# EAGLE design motorcontroller (EAGLE 5.11)
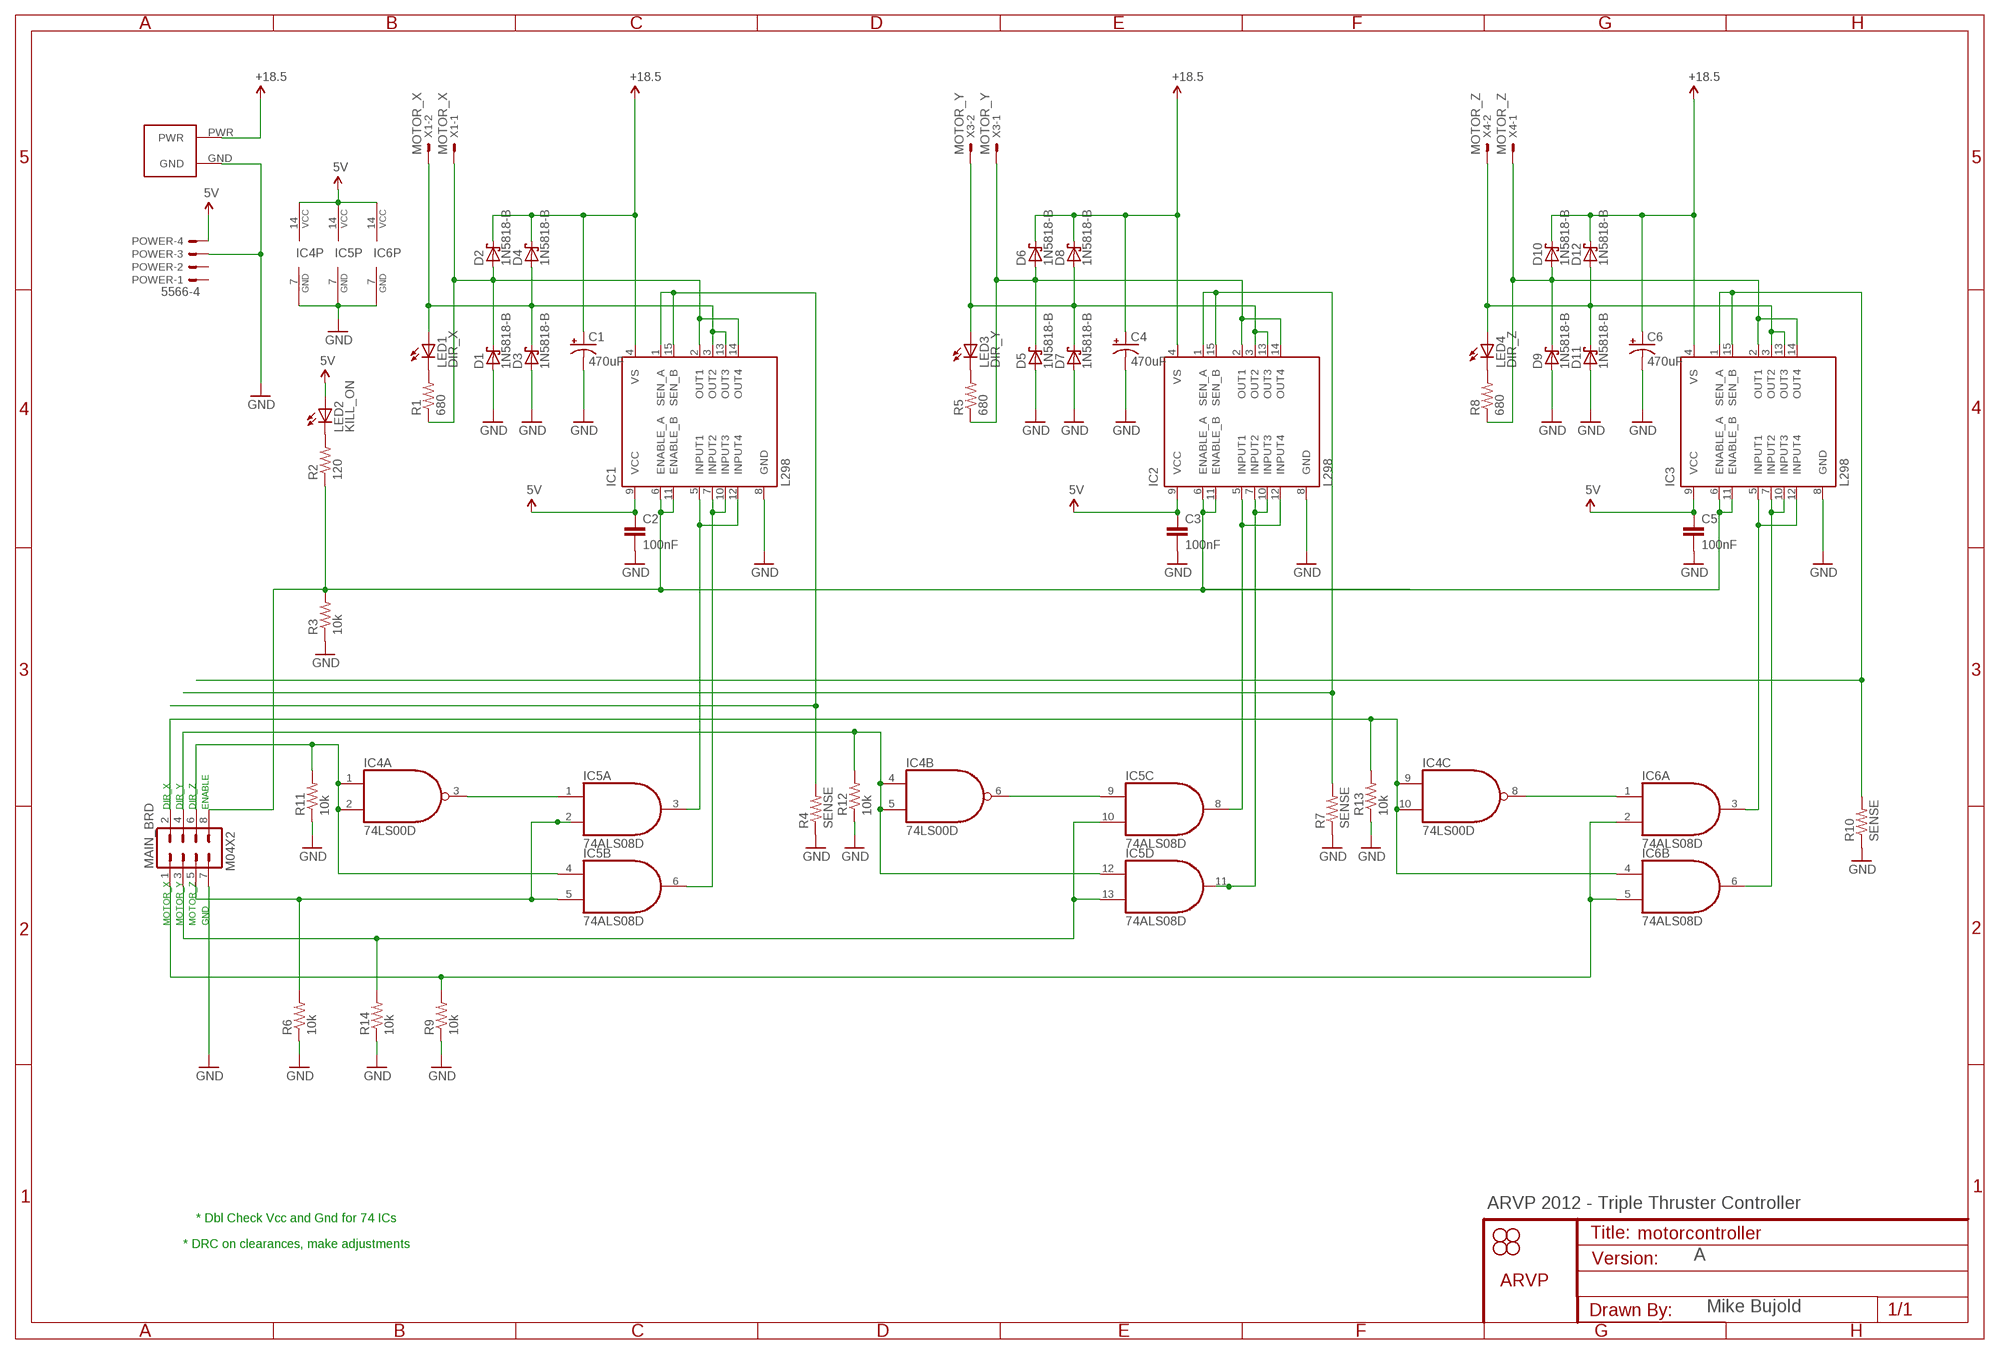
[diagram p0: schematic, sheet 1]

## Parts
C1  470uF  CAP_POLPTH4  [CPOL-RADIAL-1000UF-25V]
C2  100nF  CAPPTH  [CAP-PTH-SMALL]
C3  100nF  CAPPTH  [CAP-PTH-SMALL]
C4  470uF  CAP_POLPTH4  [CPOL-RADIAL-1000UF-25V]
C5  100nF  CAPPTH  [CAP-PTH-SMALL]
C6  470uF  CAP_POLPTH4  [CPOL-RADIAL-1000UF-25V]
D1  1N5818-B  [DO41-7.6]
D2  1N5818-B  [DO41-7.6]
D3  1N5818-B  [DO41-7.6]
D4  1N5818-B  [DO41-7.6]
D5  1N5818-B  [DO41-7.6]
D6  1N5818-B  [DO41-7.6]
D7  1N5818-B  [DO41-7.6]
D8  1N5818-B  [DO41-7.6]
D9  1N5818-B  [DO41-7.6]
D10  1N5818-B  [DO41-7.6]
D11  1N5818-B  [DO41-7.6]
D12  1N5818-B  [DO41-7.6]
IC1  L298  [MULTIWATT-15]
IC2  L298  [MULTIWATT-15]
IC3  L298  [MULTIWATT-15]
IC4  74LS00D  [SO14]
IC5  74ALS08D  [SO14]
IC6  74ALS08D  [SO14]
JP1  STAND-OFF  [STAND-OFF]
JP2  STAND-OFF  [STAND-OFF]
JP3  STAND-OFF  [STAND-OFF]
JP4  STAND-OFF  [STAND-OFF]
LED1  DIR_X  LED5MM  [LED5MM]
LED2  KILL_ON  LED5MM  [LED5MM]
LED3  DIR_Y  LED5MM  [LED5MM]
LED4  DIR_Z  LED5MM  [LED5MM]
MAIN_BRD  M04X2  [2X4]
POWER  5566-4  [5566-4]
R1  680  RESISTORPTH-1/4W  [AXIAL-0.4]
R2  120  RESISTORPTH-1/4W  [AXIAL-0.4]
R3  10k  RESISTORPTH-1/4W  [AXIAL-0.4]
R4  SENSE  RESISTORPTH-2W  [AXIAL-0.8]
R5  680  RESISTORPTH-1/4W  [AXIAL-0.4]
R6  10k  RESISTOR1206  [1206]
R7  SENSE  RESISTORPTH-2W  [AXIAL-0.8]
R8  680  RESISTORPTH-1/4W  [AXIAL-0.4]
R9  10k  RESISTOR1206  [1206]
R10  SENSE  RESISTORPTH-2W  [AXIAL-0.8]
R11  10k  RESISTOR1206  [1206]
R12  10k  RESISTOR1206  [1206]
R13  10k  RESISTOR1206  [1206]
R14  10k  RESISTOR1206  [1206]
U$4  ARVP_LOGO  [ARVP]
U$7  AND_PWR  [AND_PWR]
X1  MOTOR_X  KK-156-2  [KK-156-2]
X3  MOTOR_Y  KK-156-2  [KK-156-2]
X4  MOTOR_Z  KK-156-2  [KK-156-2]

## Nets
5V: C2.1 C3.1 C5.1 IC1.9(VCC) IC2.9(VCC) IC3.9(VCC) IC4.14(P:VCC) IC5.14(P:VCC) IC6.14(P:VCC) LED2.A POWER.4
18.5V: C1.1(+) C4.1(+) C6.1(+) D2.C D4.C D6.C D8.C D10.C D12.C IC1.4(VS) IC2.4(VS) IC3.4(VS) U$7.PWR ; supply symbol labelled +18.5
GND: C1.2(-) C2.2 C3.2 C4.2(-) C5.2 C6.2(-) D1.A D3.A D5.A D7.A D9.A D11.A IC1.8(GND) IC2.8(GND) IC3.8(GND) IC4.7(P:GND) IC5.7(P:GND) IC6.7(P:GND) MAIN_BRD.7 POWER.3 R3.P$1 R4.P$1 R6.1 R7.P$1 R9.1 R10.P$1 R11.1 R12.1 R13.1 R14.1 U$7.GND
N$2: IC1.1(SEN_A) IC1.15(SEN_B) R4.P$2
N$3: LED2.K(C) R2.P$2
N$4: IC2.5(INPUT1) IC2.12(INPUT4) IC5.8(C:O)
N$5: IC1.5(INPUT1) IC1.12(INPUT4) IC5.3(A:O)
N$6: IC1.7(INPUT2) IC1.10(INPUT3) IC5.6(B:O)
N$7: D1.C D2.A IC1.2(OUT1) IC1.14(OUT4) R1.P$1 X1.1
N$8: D3.C D4.A IC1.3(OUT2) IC1.13(OUT3) LED1.A X1.2
N$9: LED1.K(C) R1.P$2
N$10: IC2.7(INPUT2) IC2.10(INPUT3) IC5.11(D:O)
N$11: D5.C D6.A IC2.2(OUT1) IC2.14(OUT4) R5.P$1 X3.1
N$12: D7.C D8.A IC2.3(OUT2) IC2.13(OUT3) LED3.A X3.2
N$13: IC4.8(C:O) IC6.1(A:I0)
N$14: LED3.K(C) R5.P$2
N$15: IC2.1(SEN_A) IC2.15(SEN_B) R7.P$2
N$16: IC3.5(INPUT1) IC3.12(INPUT4) IC6.3(A:O)
N$17: IC3.7(INPUT2) IC3.10(INPUT3) IC6.6(B:O)
N$18: D9.C D10.A IC3.2(OUT1) IC3.14(OUT4) R8.P$1 X4.1
N$19: D11.C D12.A IC3.3(OUT2) IC3.13(OUT3) LED4.A X4.2
N$20: IC6.2(A:I1) IC6.5(B:I1) MAIN_BRD.1 R9.2
N$21: LED4.K(C) R8.P$2
N$22: IC1.6(ENABLE_A) IC1.11(ENABLE_B) IC2.6(ENABLE_A) IC2.11(ENABLE_B) IC3.6(ENABLE_A) IC3.11(ENABLE_B) MAIN_BRD.8 R2.P$1 R3.P$2
N$25: IC4.6(B:O) IC5.9(C:I0)
N$26: IC5.2(A:I1) IC5.5(B:I1) MAIN_BRD.5 R6.2
N$27: IC4.3(A:O) IC5.1(A:I0)
N$28: IC3.1(SEN_A) IC3.15(SEN_B) R10.P$2
N$31: IC5.10(C:I1) IC5.13(D:I1) MAIN_BRD.3 R14.2
N$36: IC4.1(A:I0) IC4.2(A:I1) IC5.4(B:I0) MAIN_BRD.6 R11.2
N$37: IC4.4(B:I0) IC4.5(B:I1) IC5.12(D:I0) MAIN_BRD.4 R12.2
N$38: IC4.9(C:I0) IC4.10(C:I1) IC6.4(B:I0) MAIN_BRD.2 R13.2
Unconnected: IC4.11(D:O) IC4.12(D:I0) IC4.13(D:I1) IC6.8(C:O) IC6.9(C:I0) IC6.10(C:I1) IC6.11(D:O) IC6.12(D:I0) IC6.13(D:I1) POWER.1 POWER.2

## Notes on the sheet
- DIR_X | DIR_Y | DIR_Z | ENABLE
- MOTOR_X | MOTOR_Y | MOTOR_Z | GND
- ARVP 2012 - Triple Thruster Controller
- * Dbl Check Vcc and Gnd for 74 ICs
- * DRC on clearances, make adjustments
- A
- Mike Bujold

## Library data of the parts
C1 C4 C6 = SparkFun:CAP_POL: Capacitor Polarized These are standard SMD and PTH capacitors. Normally 10uF, 47uF, and 100uF in electrolytic and tantalum varieties. Always verify the external diameter of the through hole cap, it varies with capacity, voltage, and manufacturer. The EIA devices should be standard.
C2 C3 C5 = SparkFun:CAP: Capacitor Standard 0603 ceramic capacitor, and 0.1" leaded capacitor.
D1-D12 = diode:1N581*: 1.0A SCHOTTKY BARRIER RECTIFIER Source: http://www.diodes.com/datasheets/ds23001.pdf
IC1-IC3 = st-microelectronics:L298: DUAL FULL-BRIDGE DRIVER; MPN: L298N; OC_FARNELL: 1589425; OC_NEWARK: 32M1527
IC4 = 74xx-us:74*00: Quad 2-input NAND gate
IC5 IC6 = 74xx-us:74*08: Quad 2-input AND gate
JP1-JP4 = SparkFun:STAND-OFF: Stand Off This is the mechanical footprint for a #4 phillips button head screw. Use the keepout ring to avoid running the screw head into surrounding components. SKU : PRT-00447
LED1-LED4 = led:LED: LED OSRAM: - CHIPLED LG R971, LG N971, LY N971, LG Q971, LY Q971, LO R971, LY R971 LH N974, LH R974 LS Q976, LO Q976, LY Q976 LO Q996 - Hyper CHIPLED LW Q18S LB Q993, LB Q99A, LB R99A - SideLED LS A670, LO A670, LY A670, LG A670, LP A670 LB A673, LV A673, LT A673, LW A673 LH A674 LY A675 LS A676, LA A676, LO A676, LY A676, LW A676 LS A679, LY A679, LG A679 - Hyper Micro SIDELED® LS Y876, LA Y876, LO Y876, LY Y876 LT Y87S - SmartLED LW L88C, LW L88S LB L89C, LB L89S, LG L890 LS L89K, LO L89K, LY L89K LS L896, LA L896, LO L896, LY L896 - TOPLED LS T670, LO T670, LY T670, LG T670, LP T670 LSG T670, LSP T670, LSY T670, LOP T670, LYG T670 LG T671, LOG T671, LSG T671 LB T673, LV T673, LT T673, LW T673 LH T674 LS T676, LA T676, LO T676, LY T676, LB T676, LH T676, LSB T676, LW T676 LB T67C, LV T67C, LT T67C, LS T67K, LO T67K, LY T67K, LW E67C LS E67B, LA E67B, LO E67B, LY E67B, LB E67C, LV E67C, LT E67C LW T67C LS T679, LY T679, LG T679 LS T770, LO T770, LY T770, LG T770, LP T770 LB T773, LV T773, LT T773, LW T773 LH T774 LS E675, LA E675, LY E675, LS T675 LS T776, LA T776, LO T776, LY T776, LB T776 LHGB T686 LT T68C, LB T68C - Hyper Mini TOPLED® LB M676 - Mini TOPLED Santana® LG M470 LS M47K, LO M47K, LY M47K Source: http://www.osram.convergy.de LUXEON: - LUMILED® LXK2-PW12-R00, LXK2-PW12-S00, LXK2-PW14-U00, LXK2-PW14-V00 LXK2-PM12-R00, LXK2-PM12-S00, LXK2-PM14-U00 LXK2-PE12-Q00, LXK2-PE12-R00, LXK2-PE12-S00, LXK2-PE14-T00, LXK2-PE14-U00 LXK2-PB12-K00, LXK2-PB12-L00, LXK2-PB12-M00, LXK2-PB14-N00, LXK2-PB14-P00, LXK2-PB14-Q00 LXK2-PR12-L00, LXK2-PR12-M00, LXK2-PR14-Q00, LXK2-PR14-R00 LXK2-PD12-Q00, LXK2-PD12-R00, LXK2-PD12-S00 LXK2-PH12-R00, LXK2-PH12-S00 LXK2-PL12-P00, LXK2-PL12-Q00, LXK2-PL12-R00 Source: www.luxeon.com KINGBRIGHT: KA-3528ASYC Source: www.kingbright.com
MAIN_BRD = SparkFun:M04X2
POWER = con-molex:5566-4: Mini FIT connector 4 pol Source: http://www.molex.com; OC_FARNELL: unknown; OC_NEWARK: unknown
R1-R14 = SparkFun:RESISTOR: Resistor Basic schematic elements and footprints for 0603, 1206, and PTH resistors.
U$4 = ARVP:ARVP_LOGO
U$7 = ARVP:AND_PWR
X1 X3 X4 = con-molex:KK-156-2: KK 156 HEADER Source: http://www.molex.com/pdm_docs/sd/026604100_sd.pdf; OC_FARNELL: unknown; OC_NEWARK: unknown

## Board
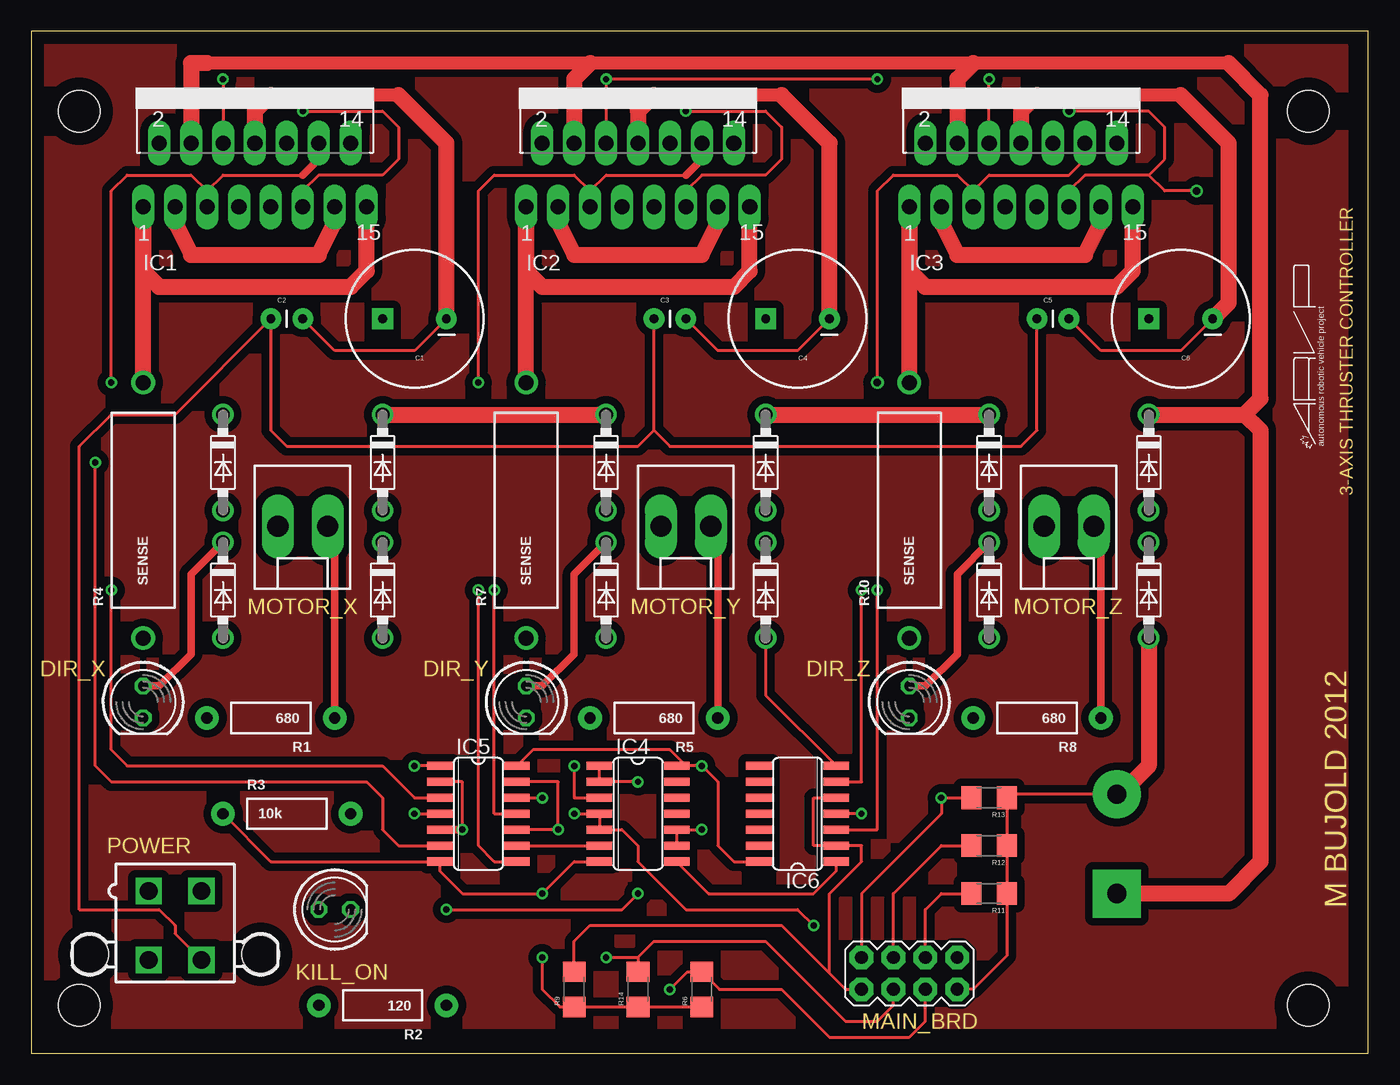
[diagram p1: board, top side]
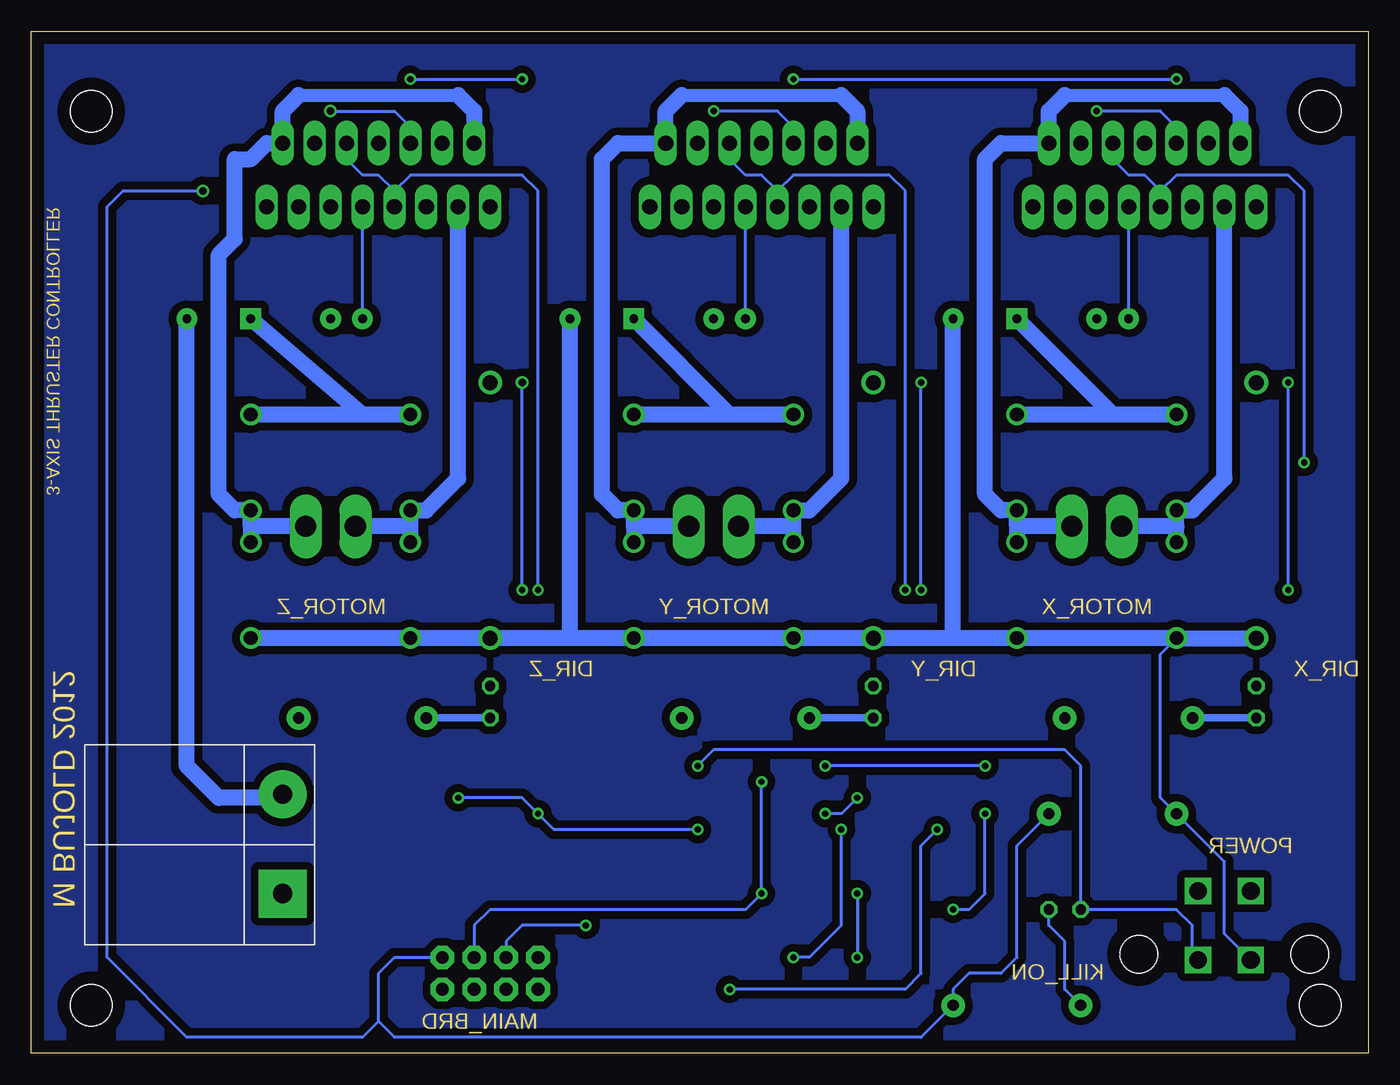
[diagram p2: board, bottom side, seen from below]

Size 106.35 x 81.27 mm. Coordinates in mm from the lower left corner, seen from the top.
Outline: 0,0 106.35,0 106.35,81.27 0,81.27 0,0
Copper layers (1*16): Top 0.035mm / dielectric 1.5mm / Bottom 0.035mm
Design rules "default *": minimum track width 10mil, minimum drill 20mil, track to track 8mil, track to pad 8mil, pad to pad 8mil, via to via 8mil, smd to smd 8mil, copper to edge 40mil, drill to drill 8mil, minimum pad ring 10mil, minimum via ring 8mil, stop-mask expansion 4mil, vias tented up to drill 0mil, thermal gap 10mil

### Footprints (pad centres in the part's own frame; a part is rotated, then mirrored left to right if it is on the bottom)
CPOL-RADIAL-1000UF-25V = drill 0.7 pad 1.651 square: 1 2.54,0 | drill 0.7 pad 1.651 round: 2 -2.54,0
CAP-PTH-SMALL = drill 0.7 pad 1.651 round: 1 0,0; 2 2.54,0
DO41-7.6 = drill 1.1 pad 1.7 round: A 3.81,0; C -3.81,0
MULTIWATT-15 = drill 1.2 long: 1 -8.89,-7.62; 2 -7.62,-2.54; 3 -6.35,-7.62; 4 -5.08,-2.54; 5 -3.81,-7.62; 6 -2.54,-2.54; 7 -1.27,-7.62; 8 0,-2.54; 9 1.27,-7.62; 10 2.54,-2.54; 11 3.81,-7.62; 12 5.08,-2.54; 13 6.35,-7.62; 14 7.62,-2.54; 15 8.89,-7.62
SO14 = smd 0.66 x 2.032: 1 -3.81,-3.073; 2 -2.54,-3.073; 3 -1.27,-3.073; 4 0,-3.073; 5 1.27,-3.073; 6 2.54,-3.073; 7 3.81,-3.073; 8 3.81,3.073; 9 2.54,3.073; 10 1.27,3.073; 11 0,3.073; 12 -1.27,3.073; 13 -2.54,3.073; 14 -3.81,3.073
STAND-OFF = hole 3.302: 0,0
LED5MM = drill 0.813 octagon: A -1.27,0; K 1.27,0
2X4 = drill 1.016 pad 1.88 octagon: 1 -3.81,-1.27; 2 -3.81,1.27; 3 -1.27,-1.27; 4 -1.27,1.27; 5 1.27,-1.27; 6 1.27,1.27; 7 3.81,-1.27; 8 3.81,1.27
5566-4 = drill 1.4 square: 1 2.1,-2.75; 2 -2.1,-2.75; 3 2.1,2.75; 4 -2.1,2.75 | hole 3: 6.8,2.29; -6.8,2.29
AXIAL-0.4 = drill 0.9 pad 1.88 round: P$1 -5.08,0; P$2 5.08,0
AXIAL-0.8 = drill 1.2 pad 1.88 round: P$1 -10.16,0; P$2 10.16,0
1206 = smd 1.6 x 1.8: 1 -1.4,0; 2 1.4,0
AND_PWR = drill 1.524 pad 3.81 round: GND 0,-7.886 | drill 1.524 pad 3.81 square: PWR 0,0
KK-156-2 = drill 1.7 pad 2.184 long: 1 -1.98,0; 2 1.98,0

### Placement (x,y rotation side)
C1  30.48,58.42 180 top
C2  19.05,58.42 0 top
C3  49.53,58.42 0 top
C4  60.96,58.42 180 top
C5  80.01,58.42 0 top
C6  91.44,58.42 180 top
D1  27.94,36.83 270 top
D2  27.94,46.99 270 top
D3  15.24,36.83 270 top
D4  15.24,46.99 270 top
D5  58.42,36.83 270 top
D6  58.42,46.99 270 top
D7  45.72,36.83 270 top
D8  45.72,46.99 270 top
D9  88.9,36.83 270 top
D10  88.9,46.99 270 top
D11  76.2,36.83 270 top
D12  76.2,46.99 270 top
IC1  17.78,74.93 0 top
IC2  48.26,74.93 0 top
IC3  78.74,74.93 0 top
IC4  48.26,19.05 270 top
IC5  35.56,19.05 270 top
IC6  60.96,19.05 90 top
JP1  3.81,3.81 0 top
JP2  101.6,3.81 0 top
JP3  3.81,74.93 0 top
JP4  101.6,74.93 0 top
LED1  8.89,27.94 270 top
LED2  24.13,11.43 0 top
LED3  39.37,27.94 270 top
LED4  69.85,27.94 270 top
MAIN_BRD  69.85,6.35 0 top
POWER  11.43,10.16 180 top
R1  19.05,26.67 180 top
R2  27.94,3.81 180 top
R3  20.32,19.05 0 top
R4  8.89,43.18 90 top
R5  49.53,26.67 180 top
R6  53.34,5.08 90 top
R7  39.37,43.18 90 top
R8  80.01,26.67 180 top
R9  43.18,5.08 90 top
R10  69.85,43.18 90 top
R11  76.2,12.7 180 top
R12  76.2,16.51 180 top
R13  76.2,20.32 180 top
R14  48.26,5.08 90 top
U$4  102.87,48.26 90 top
U$7  86.36,12.7 180 bottom
X1  21.59,41.91 180 top
X3  52.07,41.91 180 top
X4  82.55,41.91 180 top

### Tracks (layer width: path | path; a pad name or v marks a point on that pad's centre or on a via)
5V  (via drill 0.51)
  Top 0.254: POWER.4 11.43,9.51 11.43,10.16 10.16,11.43 3.81,11.43 3.81,48.26 6.35,50.8 11.43,50.8 C2.1 19.05,49.53 20.32,48.26 48.26,48.26 49.53,49.53 | 49.53,49.53 C3.1 | C5.1 80.01,49.53 78.74,48.26 50.8,48.26 49.53,49.53 | 52.07,22.86 v53.34,22.86 54.61,21.59 54.61,16.51 55.88,15.24 IC6.14 | IC5.14 39.9,24.13 50.8,24.13 52.07,22.86 | 52.07,22.86 IC4.14
  Bottom 0.254: C5.1 IC3.9 | C3.1 IC2.9 | C2.1 IC1.9 | POWER.4 13.97,7.85 13.97,10.16 15.24,11.43 LED2.A 22.86,22.86 24.13,24.13 52.07,24.13 v53.34,22.86
18.5V
  Top 1.016: 95.25,78.74 74.93,78.74 44.45,78.74 13.97,78.74
  Top 1.27: 74.93,78.74 73.66,77.47 IC3.4 | 96.52,50.8 97.79,52.07 97.79,76.2 95.25,78.74 | D10.C 96.52,50.8 | 96.52,50.8 97.79,49.53 97.79,15.24 95.25,12.7 U$7.PWR | 44.45,78.74 43.18,77.47 IC2.4 | 13.97,78.74 12.7,78.74 IC1.4 | D2.C D8.C | D6.C D12.C
  Bottom 1.27: D4.C 20.32,50.8 | 20.32,50.8 D2.C | 20.32,50.8 C1.1 | 50.8,50.8 D6.C | D8.C 50.8,50.8 | 50.8,50.8 C4.1 | 80.01,50.8 D10.C | D12.C 80.01,50.8 | 80.01,50.8 C6.1
GND  (via drill 0.51)
  Top 0.254: C5.2 85.09,55.88 91.44,55.88 C6.2 | C3.2 54.61,55.88 60.96,55.88 C4.2 | C2.2 24.13,55.88 30.48,55.88 C1.2 | MAIN_BRD.7 74.93,5.08 77.6,7.75 R11.1 R12.1 R13.1 77.87,20.59 U$7.GND | R6.1 R14.1 R9.1 42.04,3.68 40.64,5.08 v40.64,7.62 | IC4.7 43.18,15.24 v40.64,12.7 34.29,12.7 32.49,14.5 IC5.7 19.05,15.24 R3.P$1 | IC6.7 58.42,28.47 D5.A
  Top 1.016: 59.69,76.2 49.53,76.2 | 29.21,76.2 19.05,76.2 | 91.44,76.2 80.01,76.2
  Top 1.27: 80.01,76.2 78.74,74.93 IC3.8 | IC2.8 48.26,74.93 49.53,76.2 | 59.69,76.2 63.5,72.39 C4.2 | C1.2 33.02,72.39 29.21,76.2 | 19.05,76.2 17.78,74.93 IC1.8 | C6.2 95.25,59.69 95.25,72.39 91.44,76.2 | D9.A 88.9,22.86 86.63,20.59 U$7.GND
  Bottom 0.254: POWER.3 11.43,9.51 11.43,15.24 R3.P$1 16.51,20.32 16.51,31.75 D3.A | v40.64,12.7 v40.64,7.62
  Bottom 1.27: D9.A D11.A R10.P$1 63.5,33.02 | C6.2 93.98,22.86 91.44,20.32 86.36,20.32 U$7.GND | 63.5,33.02 D5.A D7.A R7.P$1 33.02,33.02 | R4.P$1 D3.A D1.A 33.02,33.02 | 33.02,33.02 C1.2 | 63.5,33.02 C4.2
N$1
  pour Bottom (isolate 0.61): 1.27,80.01 105.41,80.01 105.41,1.27 1.27,1.27 1.27,78.74
N$2
  Top 1.27: IC1.15 26.67,62.23 25.4,60.96 10.16,60.96 8.89,62.23 IC1.1 R4.P$2
N$3
  Bottom 0.254: R2.P$2 24.13,5.08 24.13,8.89 25.4,10.16 LED2.K
N$4  (via drill 0.51)
  Top 0.254: 52.07,69.85 45.72,69.85 44.45,68.58 | 44.45,68.58 IC2.5 | 44.45,68.58 43.18,69.85 36.83,69.85 35.56,68.58 v35.56,53.34 | v35.56,36.83 35.56,16.51 36.83,15.24 IC5.8
  Top 0.61: IC2.12 53.34,71.12 52.07,69.85
  Bottom 0.254: v35.56,36.83 v35.56,53.34
N$5  (via drill 0.51)
  Top 0.254: 13.97,68.58 15.24,69.85 21.59,69.85 | IC5.3 30.48,20.32 27.94,22.86 7.62,22.86 6.35,24.13 v6.35,36.83 | 13.97,68.58 IC1.5 | 13.97,68.58 12.7,69.85 7.62,69.85 6.35,68.58 v6.35,53.34
  Top 0.61: 21.59,69.85 22.86,71.12 IC1.12
  Bottom 0.254: v6.35,36.83 v6.35,53.34
N$6  (via drill 0.51)
  Top 0.254: IC5.6 29.21,16.51 27.94,17.78 27.94,20.32 26.67,21.59 6.35,21.59 5.08,22.86 v5.08,46.99
  Bottom 0.254: 16.51,68.58 17.78,69.85 19.05,69.85 20.32,71.12 IC1.10 | 16.51,68.58 IC1.7 | 16.51,68.58 15.24,69.85 6.35,69.85 5.08,68.58 v5.08,46.99
N$7
  Top 0.61: R1.P$1 24.13,40.64 23.57,41.2 X1.1
  Bottom 1.016: 24.13,76.2 11.43,76.2
  Bottom 1.27: IC1.2 10.16,74.93 11.43,76.2 | 24.13,76.2 25.4,74.93 IC1.14 29.21,72.39 30.48,71.12 30.48,44.45 29.21,43.18 D2.A 27.94,41.91 | 27.94,41.91 D1.C | X1.1 27.94,41.91
N$8
  Top 0.61: D3.C 12.7,38.1 12.7,31.75 10.16,29.21 LED1.A
  Top 1.27: IC1.3 11.43,66.04 12.7,63.5 22.86,63.5 24.13,66.04 IC1.13
  Bottom 1.27: D3.C 15.24,41.91 | 15.24,41.91 D4.A 13.97,43.18 11.43,45.72 IC1.3 | 15.24,41.91 X1.2
N$9
  Bottom 0.61: LED1.K R1.P$2
N$10  (via drill 0.51)
  Top 0.254: v36.83,36.83 36.83,19.05 IC5.11
  Bottom 0.254: IC2.10 50.8,71.12 49.53,69.85 48.26,69.85 46.99,68.58 | 46.99,68.58 IC2.7 | 46.99,68.58 45.72,69.85 38.1,69.85 36.83,68.58 v36.83,36.83
N$11
  Top 0.61: R5.P$1 54.61,41.91 X3.1
  Bottom 1.016: 54.61,76.2 41.91,76.2
  Bottom 1.27: IC2.2 40.64,74.93 41.91,76.2 | 54.61,76.2 55.88,74.93 IC2.14 59.69,72.39 60.96,71.12 60.96,44.45 59.69,43.18 D6.A 58.42,41.91 | 58.42,41.91 D5.C | X3.1 58.42,41.91
N$12
  Top 0.61: LED3.A 40.64,29.21 43.18,31.75 43.18,38.1 D7.C
  Top 1.27: IC2.3 41.91,66.04 43.18,63.5 53.34,63.5 54.61,66.04 IC2.13
  Bottom 1.27: D7.C 45.72,41.91 | 45.72,41.91 D8.A 44.45,43.18 41.91,45.72 IC2.3 | 45.72,41.91 X3.2
N$13
  Top 0.254: IC4.8 53.87,12.7 62.23,12.7 64.03,14.5 IC6.1
N$14
  Bottom 0.61: LED3.K R5.P$2
N$15
  Top 1.27: IC2.15 57.15,62.23 55.88,60.96 40.64,60.96 39.37,62.23 IC2.1 R7.P$2
N$16  (via drill 0.51, 0.6)
  Top 0.254: IC3.12 83.82,71.12 82.55,69.85 76.2,69.85 74.93,68.58 | 74.93,68.58 IC3.5 | 74.93,68.58 73.66,69.85 68.58,69.85 67.31,68.58 v67.31,53.34 | IC6.3 67.31,17.78 v67.31,36.83
  Bottom 0.254: v67.31,36.83 v67.31,53.34
N$17  (via drill 0.51)
  Top 0.254: IC6.6 66.04,21.59 v66.04,36.83
  Bottom 0.254: IC3.10 81.28,71.12 80.01,69.85 78.74,69.85 77.47,68.58 | 77.47,68.58 IC3.7 | 77.47,68.58 76.2,69.85 67.31,69.85 66.04,68.58 v66.04,36.83
N$18
  Top 0.61: R8.P$1 85.09,41.35 X4.1
  Bottom 1.016: 85.09,76.2 72.39,76.2
  Bottom 1.27: 85.09,76.2 86.36,74.93 IC3.14 87.63,72.39 88.9,71.12 90.17,71.12 90.17,64.77 91.44,63.5 91.44,44.45 90.17,43.18 D10.A 88.9,41.91 | 72.39,76.2 71.12,74.93 IC3.2 | 88.9,41.91 D9.C | X4.1 88.9,41.91
N$19
  Top 0.61: LED4.A 71.12,29.21 73.66,31.75 73.66,38.1 D11.C
  Top 1.27: IC3.3 72.39,66.04 73.66,63.5 83.82,63.5 85.09,66.04 IC3.13
  Bottom 1.27: D11.C 76.2,41.91 | 76.2,41.91 D12.A 74.93,43.18 72.39,45.72 IC3.3 | 76.2,41.91 X4.2
N$20
  Top 0.254: IC6.5 62.23,20.32 62.23,16.51 IC6.2 66.04,16.51 66.04,15.24 63.5,12.7 63.5,6.35 | R9.2 43.18,8.89 44.45,10.16 59.69,10.16 63.5,6.35 | 63.5,6.35 64.77,5.08 MAIN_BRD.1
N$21
  Bottom 0.61: LED4.K R8.P$2
N$22  (via drill 0.51, 0.6)
  Top 0.254: IC3.11 82.55,68.58 83.82,69.85 88.9,69.85 | v82.55,74.93 88.9,74.93 90.17,73.66 90.17,71.12 88.9,69.85 | IC3.6 v76.2,77.47 | IC2.11 52.07,68.58 53.34,69.85 58.42,69.85 59.69,71.12 59.69,73.66 58.42,74.93 v52.07,74.93 | v67.31,77.47 v45.72,77.47 IC2.6 | IC1.11 21.59,68.58 22.86,69.85 27.94,69.85 29.21,71.12 29.21,73.66 27.94,74.93 v21.59,74.93 | v15.24,77.47 IC1.6 | 88.9,69.85 90.17,68.58 v92.71,68.58
  Bottom 0.254: v82.55,74.93 77.47,74.93 76.2,73.66 IC3.6 | v76.2,77.47 v67.31,77.47 | v45.72,77.47 v15.24,77.47 | v21.59,74.93 16.51,74.93 15.24,73.66 IC1.6 | 78.74,2.54 77.47,1.27 35.56,1.27 R2.P$1 33.02,5.08 31.75,6.35 29.21,6.35 27.94,7.62 27.94,16.51 R3.P$2 | 78.74,2.54 78.74,6.35 77.47,7.62 MAIN_BRD.8 | 78.74,2.54 80.01,1.27 93.98,1.27 100.33,7.62 100.33,67.31 99.06,68.58 v92.71,68.58 | v52.07,74.93 46.99,74.93 45.72,73.66 IC2.6
N$23
  pour Top (isolate 0.61): 1.27,80.01 104.14,80.01 104.14,2.54 1.27,2.54
N$25
  Top 0.254: IC5.9 IC4.6 45.72,16.51
N$26  (via drill 0.51)
  Top 0.254: v34.29,17.78 34.29,21.59 IC5.2 | MAIN_BRD.5 71.12,2.54 69.85,1.27 63.5,1.27 59.69,5.08 54.74,5.08 R6.2 52.2,6.48 v50.8,5.08
  Top 0.61: v34.29,17.78 IC5.5
  Bottom 0.254: v34.29,17.78 35.56,16.51 35.56,6.35 36.83,5.08 v50.8,5.08
N$27  (via drill 0.51)
  Top 0.254: IC4.3 43.18,20.32 v43.18,22.86 | IC5.1 v30.48,22.86
  Bottom 0.254: v30.48,22.86 v43.18,22.86
N$28
  Top 1.27: R10.P$2 IC3.1 69.85,62.23 71.12,60.96 86.36,60.96 87.63,62.23 IC3.15
N$31  (via drill 0.51)
  Top 0.254: 38.1,21.59 IC5.13 41.91,21.59 v41.91,17.78 IC5.10 | 48.26,7.62 R14.2 | 48.26,7.62 49.53,8.89 58.42,8.89 64.77,2.54 67.31,2.54 68.58,3.81 MAIN_BRD.3 | v45.72,7.62 48.26,7.62
  Bottom 0.254: v41.91,17.78 41.91,10.16 44.45,7.62 v45.72,7.62
N$36  (via drill 0.51)
  Top 0.254: IC4.1 IC4.2 v48.26,21.59 | v30.48,19.05 IC5.4 | v33.02,11.43 46.99,11.43 v48.26,12.7 | MAIN_BRD.6 71.12,11.43 72.39,12.7 R11.2
  Bottom 0.254: v30.48,19.05 30.48,12.7 31.75,11.43 v33.02,11.43 | v48.26,21.59 v48.26,12.7 49.53,11.43 69.85,11.43 71.12,10.16 MAIN_BRD.6
N$37  (via drill 0.51)
  Top 0.254: IC4.4 IC4.5 46.99,17.78 48.26,16.51 48.26,15.24 52.07,11.43 60.96,11.43 v62.23,10.16 | IC4.4 45.72,19.05 | IC5.12 v40.64,20.32 | v43.18,19.05 IC4.4 | R12.2 72.39,16.51 68.58,12.7 MAIN_BRD.4
  Bottom 0.254: v40.64,20.32 41.91,19.05 v43.18,19.05 | v62.23,10.16 67.31,10.16 68.58,8.89 MAIN_BRD.4
N$38  (via drill 0.51)
  Top 0.254: IC4.9 IC4.10 v53.34,17.78 | v66.04,19.05 IC6.4 | R13.2 v72.39,20.32 72.39,19.05 66.04,12.7 MAIN_BRD.2
  Bottom 0.254: v72.39,20.32 67.31,20.32 v66.04,19.05 64.77,17.78 v53.34,17.78

### Text on the board
Dimension: 3-AXIS THRUSTER CONTROLLER | M BUJOLD 2012